# EAGLE design SH-SwitchNode-CT1 Shield (EAGLE 7.2.0)
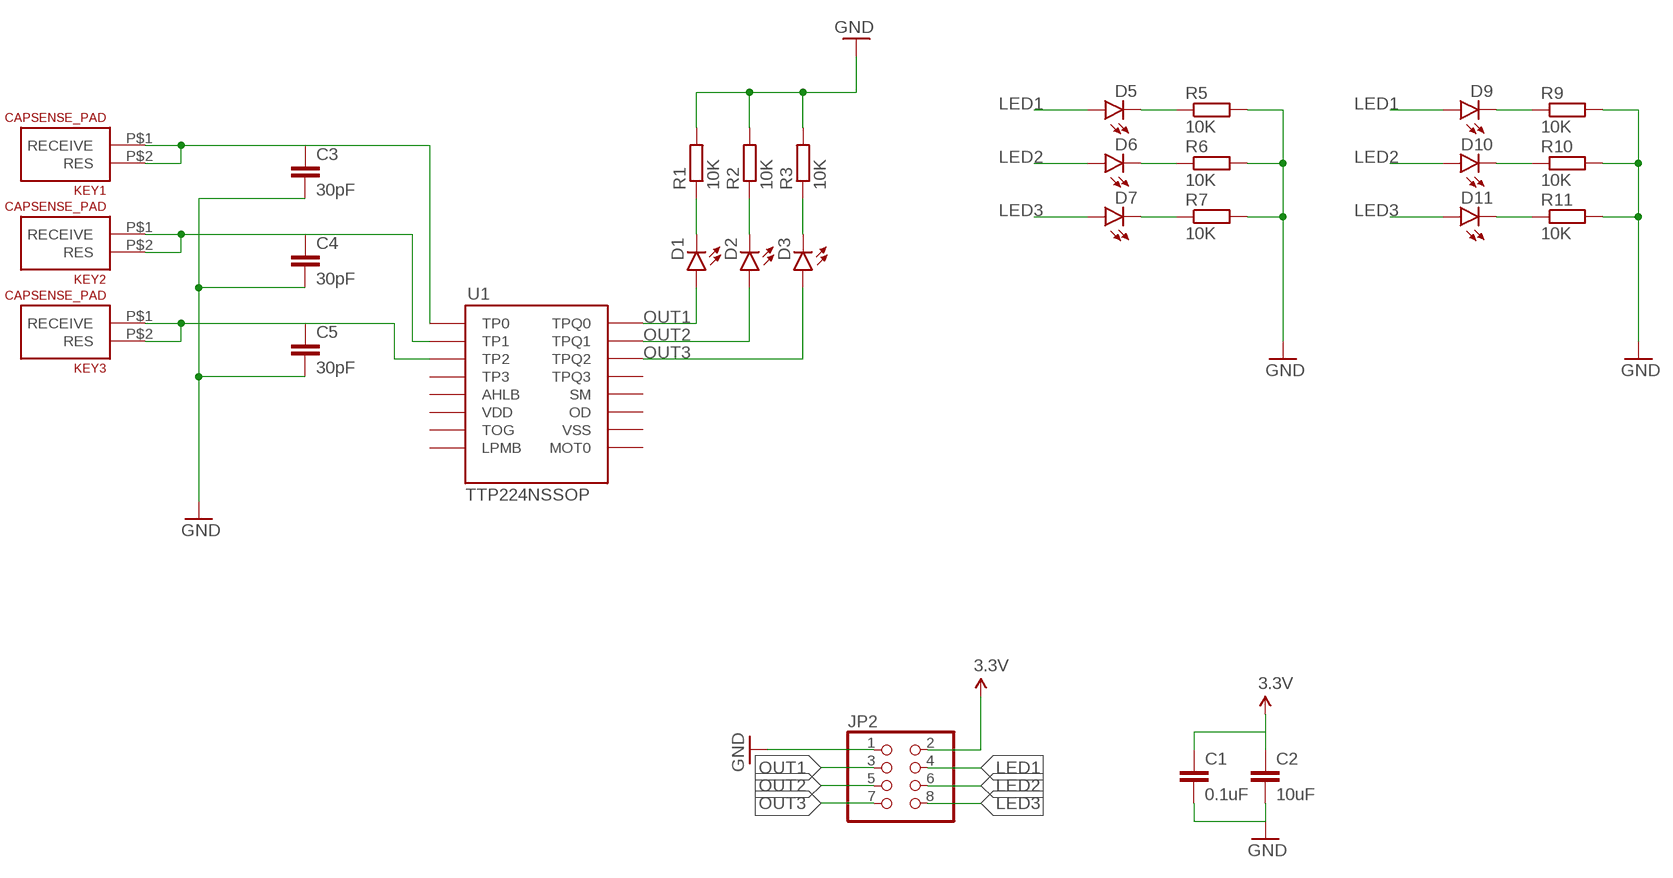
[diagram p0: schematic, sheet 1]

## Parts
C1  0.1uF  CAP0805  [0805]
C2  10uF  CAP0805  [0805]
C3  30pF  CAP0805  [0805]
C4  30pF  CAP0805  [0805]
C5  30pF  CAP0805  [0805]
D1  LED1206-BOTTOM  [LED-1206-BOTTOM]
D2  LED1206-BOTTOM  [LED-1206-BOTTOM]
D3  LED1206-BOTTOM  [LED-1206-BOTTOM]
D5  LED1206-BOTTOM  [LED-1206-BOTTOM]
D6  LED1206-BOTTOM  [LED-1206-BOTTOM]
D7  LED1206-BOTTOM  [LED-1206-BOTTOM]
D9  LED1206-BOTTOM  [LED-1206-BOTTOM]
D10  LED1206-BOTTOM  [LED-1206-BOTTOM]
D11  LED1206-BOTTOM  [LED-1206-BOTTOM]
JP2  PINHD-2X4  [2X04]
KEY1  CAPSENSE_PAD  [CAPSENSE_PAD]
KEY2  CAPSENSE_PAD  [CAPSENSE_PAD]
KEY3  CAPSENSE_PAD  [CAPSENSE_PAD]
R1  10K  R-EU_R0805  [R0805]
R2  10K  R-EU_R0805  [R0805]
R3  10K  R-EU_R0805  [R0805]
R5  10K  R-EU_R0805  [R0805]
R6  10K  R-EU_R0805  [R0805]
R7  10K  R-EU_R0805  [R0805]
R9  10K  R-EU_R0805  [R0805]
R10  10K  R-EU_R0805  [R0805]
R11  10K  R-EU_R0805  [R0805]
U1  TTP224NSSOP  [SSOP16]

## Nets
3.3V: C1.1 C2.1 JP2.2
GND: C1.2 C2.2 C3.2 C4.2 C5.2 JP2.1 R1.2 R2.2 R3.2 R5.2 R6.2 R7.2 R9.2 R10.2 R11.2
KEY1: C3.1 KEY1.P$1(RECEIVE) KEY1.P$2(RES) U1.1(TP0)
KEY2: C4.1 KEY2.P$1(RECEIVE) KEY2.P$2(RES) U1.2(TP1)
KEY3: C5.1 KEY3.P$1(RECEIVE) KEY3.P$2(RES) U1.3(TP2)
LED1: D5.A D9.A JP2.4
LED2: D6.A D10.A JP2.6
LED3: D7.A D11.A JP2.8
N$6: D5.C R5.1
N$7: D6.C R6.1
N$11: D1.C R1.1
N$12: D7.C R7.1
N$16: D9.C R9.1
N$18: D2.C R2.1
N$19: D3.C R3.1
N$21: D10.C R10.1
N$22: D11.C R11.1
OUT1: D1.A JP2.3 U1.16(TPQ0)
OUT2: D2.A JP2.5 U1.15(TPQ1)
OUT3: D3.A JP2.7 U1.14(TPQ2)
Unconnected: U1.4(TP3) U1.5(AHLB) U1.7(TOG) U1.8(LPMB) U1.9(MOT0) U1.11(OD) U1.12(SM) U1.13(TPQ3)

## Power pins joined to a net without a drawn wire
VDD: U1.6(VDD)
VSS: U1.10(VSS)

## Library data of the parts
C1-C5 = SparkFun-Capacitors:CAP: Capacitor Standard 0603 ceramic capacitor, and 0.1" leaded capacitor.
D1-D3 D5-D7 D9-D11 = SparkFun-LED:LED: LEDs Standard schematic elements and footprints for 5mm, 3mm, 1206, and 0603 sized LEDs. 5mm - Spark Fun Electronics SKU : COM-00529 (and others)
JP2 = adafruit:PINHD-2X4: PIN HEADER
KEY1-KEY3 = SparkFun-Electromechanical:CAPSENSE_PAD: Generic copper pad for a capacitive touch sensor.
R1-R3 R5-R7 R9-R11 = rcl:R-EU_: RESISTOR, European symbol
U1 = My Eagle Lib:TTP224N: The TTP224N-BSB TonTouchTM IC is capacitive sensing design specifically for touch pad controls. The device built in regulator for touch sensor. Stable sensing method can cover diversity conditions. Human interfaces control panel links through non-conductive dielectric material. The main application is focused at replacing of the mechanical switch or button. The ASSP can independently handle the 4 touch pads with 4 direct output pins.

## Board
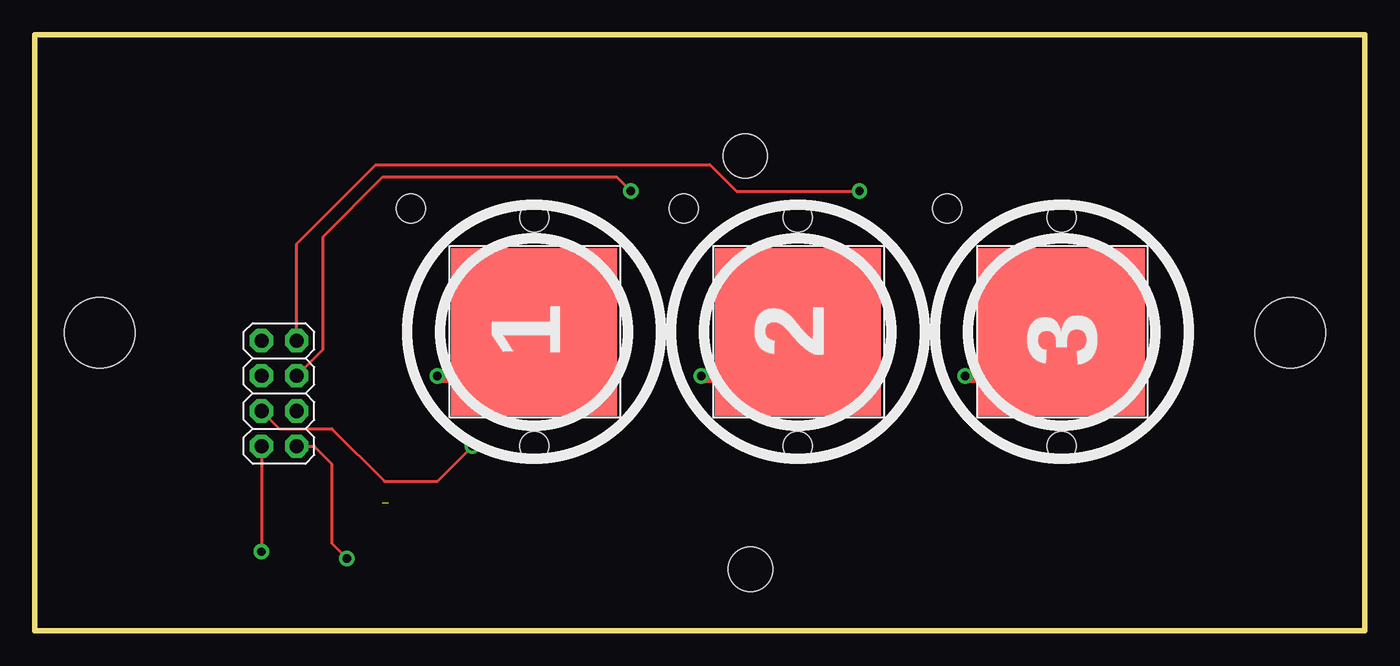
[diagram p1: board, top side]
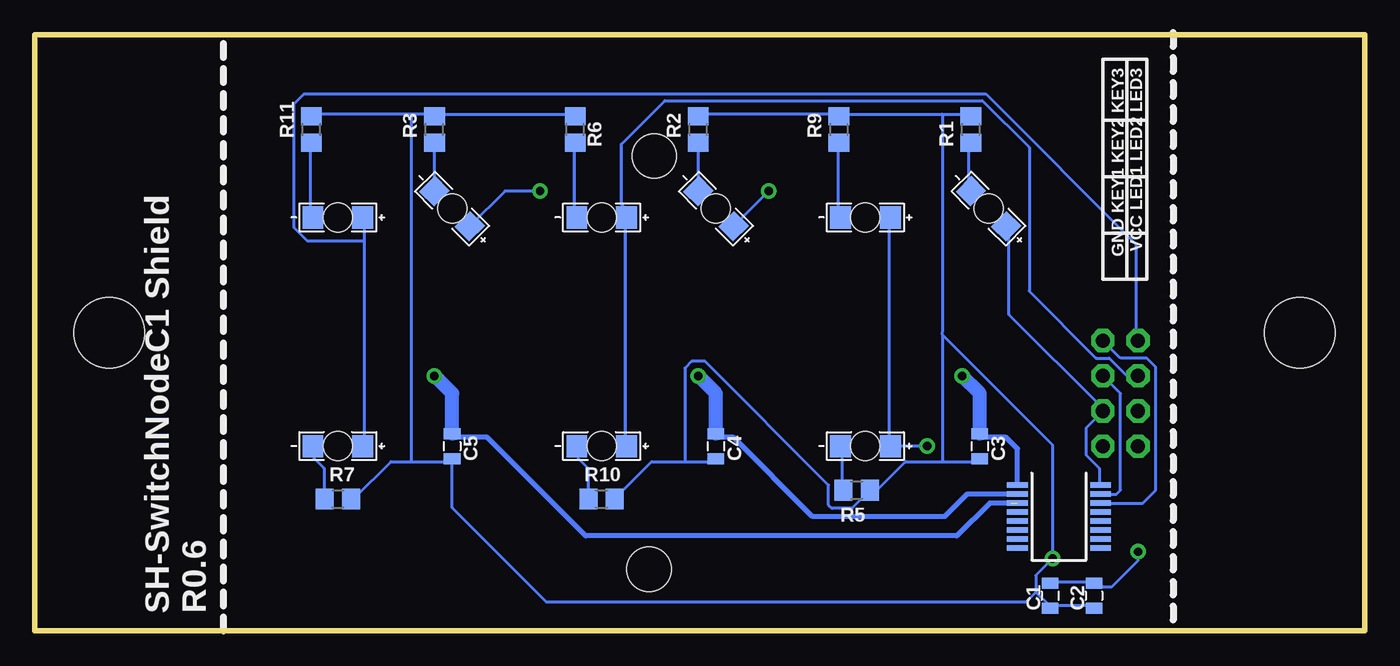
[diagram p2: board, bottom side, seen from below]

Size 96.06 x 43.04 mm. Coordinates in mm from the lower left corner, seen from the top.
Outline: 0,0 96.06,0 96.06,43.04 0,43.04 0,0
Copper layers (1*16): Top 0.035mm / dielectric 1.5mm / Bottom 0.035mm
Design rules "default *": minimum track width 9mil, minimum drill 24mil, track to track 10mil, track to pad 10mil, pad to pad 10mil, via to via 10mil, smd to smd 8mil, copper to edge 20mil, drill to drill 12mil, minimum pad ring 13mil, minimum via ring 10mil, stop-mask expansion 4mil, vias tented up to drill 0mil, thermal gap 10mil
Holes 3.2 mm at 51.31,34.29 51.69,4.45
Holes 5.08 mm at 4.7,21.52 90.68,21.52

### Footprints (pad centres in the part's own frame; a part is rotated, then mirrored left to right if it is on the bottom)
0805 = smd 0.8 x 1.2: 1 -0.9,0; 2 0.9,0
LED-1206-BOTTOM = smd 1.5 x 1.6: A -1.8,0; C 1.8,0 | hole 2.1: 0,0
2X04 = drill 1.016 pad 1.676 octagon: 1 -3.81,-1.27; 2 -3.81,1.27; 3 -1.27,-1.27; 4 -1.27,1.27; 5 1.27,-1.27; 6 1.27,1.27; 7 3.81,-1.27; 8 3.81,1.27
CAPSENSE_PAD = smd 12 x 6.1: P$1 0,3; P$2 0,-3
R0805 = smd 1.3 x 1.5: 1 -0.95,0; 2 0.95,0
SSOP16 = smd 0.4 x 1.5: 1 -2.275,-3.625; 2 -1.625,-3.625; 3 -0.975,-3.625; 4 -0.325,-3.625; 5 0.325,-3.625; 6 0.975,-3.625; 7 1.625,-3.625; 8 2.275,-3.625; 9 2.275,2.375; 10 1.625,2.375; 11 0.975,2.375; 12 0.325,2.375; 13 -0.325,2.375; 14 -0.975,2.375; 15 -1.625,2.375; 16 -2.275,2.375

### Placement (x,y rotation side)
C1  22.73,2.54 270 bottom
C2  19.56,2.54 270 bottom
C3  27.81,13.34 270 bottom
C4  46.86,13.34 270 bottom
C5  65.91,13.34 270 bottom
D1  27.18,30.48 135 bottom
D2  46.86,30.48 135 bottom
D3  65.91,30.48 135 bottom
D5  36.07,13.34 180 bottom
D6  55.12,29.84 180 bottom
D7  74.17,13.34 180 bottom
D9  36.07,29.84 180 bottom
D10  55.12,13.34 180 bottom
D11  74.17,29.84 180 bottom
JP2  17.65,17.14 90 top
KEY1  36.07,21.59 0 top
KEY2  55.12,21.59 0 top
KEY3  74.17,21.59 0 top
R1  28.45,36.19 90 bottom
R2  48.13,36.19 90 bottom
R3  67.18,36.19 90 bottom
R5  36.7,10.16 0 bottom
R6  57.02,36.19 90 bottom
R7  74.17,9.52 0 bottom
R9  37.97,36.19 90 bottom
R10  55.12,9.52 0 bottom
R11  76.07,36.19 90 bottom
U1  21.46,8.25 270 bottom

### Tracks (layer width: path | path; a pad name or v marks a point on that pad's centre or on a via)
3.3V  (via drill 0.61)
  Top 0.229: JP2.2 v16.38,5.71
  Bottom 0.229: C1.1 22.55,3.53 19.66,3.53 C2.1 19.19,3.44 18.92,3.17 18.29,3.17 16.38,5.08 v16.38,5.71
GND  (via drill 0.61)
  Top 0.229: JP2.1 20.19,13.34 21.46,12.06 21.46,6.31 v22.55,5.22
  Bottom 0.229: 68.88,12.22 70.33,12.22 72.99,9.56 R7.2 | 68.88,12.22 65.99,12.22 C5.2 | R6.2 57.06,37.31 66.95,37.31 R3.2 67.2,37.31 68.88,37.31 | 68.88,37.31 75.88,37.31 R11.2 | 68.88,37.31 68.88,12.22 | C2.2 19.66,1.84 22.55,1.84 C1.2 22.8,1.84 23.76,2.81 | 23.76,2.81 23.76,4.01 v22.55,5.22 22.55,13.42 30.52,21.39 | 49.1,12.22 51.51,12.22 54.17,9.56 R10.2 | 49.1,12.22 46.93,12.22 C4.2 | 30.52,12.22 33.17,12.22 35.1,10.29 35.59,10.29 R5.2 35.83,10.05 37.03,8.84 38.48,8.84 38.72,9.08 38.72,10.53 47.65,19.46 48.62,19.46 49.1,18.97 49.1,12.22 | 30.52,12.22 27.86,12.22 C3.2 | 30.52,37.31 37.76,37.31 R9.2 38,37.31 48.13,37.31 R2.2 | 30.52,37.31 28.59,37.31 R1.2 | 30.52,37.31 30.52,21.59 30.52,21.39 | 30.52,21.39 30.52,12.22 | 23.76,2.81 24.49,2.08 59.11,2.08 65.91,8.89 C5.2 | 65.75,12.22 C5.2
  pour Top (isolate 7.62): -2.67,45.08 99.57,45.08 99.57,-2.54 -2.67,-2.54
  pour Bottom (isolate 7.62): -2.67,45.08 99.57,45.08 99.57,-2.54 -2.67,-2.54 -2.67,44.45
KEY1  (via drill 0.61)
  Top 0.229: KEY1.P$2 KEY1.P$1
  Top 0.457: 35.89,18.41 KEY1.P$2
  Top 1.016: v29.08,18.41 35.89,18.41
  Bottom 0.356: C3.1 27.55,13.97 25.91,13.97 25.09,13.15 U1.1
  Bottom 1.016: C3.1 27.81,17.14 v29.08,18.41
KEY2  (via drill 0.61)
  Top 0.229: KEY2.P$1 55.13,24.52 55.13,18.73 KEY2.P$2
  Top 0.457: 54.94,18.41 KEY2.P$2
  Top 1.016: v48.13,18.41 54.94,18.41
  Bottom 0.356: C4.1 46.6,13.97 45.59,13.97 39.88,8.25 30.35,8.25 28.73,9.88 U1.2
  Bottom 1.016: C4.1 46.86,17.14 v48.13,18.41
KEY3  (via drill 0.61)  (1 unrouted)
  Top 0.229: KEY3.P$1 74.19,24.52 74.19,18.73 KEY3.P$2
  Top 0.457: 73.99,18.41 KEY3.P$2
  Top 1.016: v67.18,18.41 73.99,18.41
  Bottom 0.356: C5.1 65.65,13.97 63.37,13.97 56.26,6.86 29.46,6.86 27.09,9.23 25.57,9.23
  Bottom 1.016: C5.1 65.91,17.14 v67.18,18.41
LED1  (via drill 0.61)
  Top 0.229: JP2.4 17.65,14.6 21.46,14.6 25.27,10.79 29.08,10.79 v31.62,13.34
  Bottom 0.229: D9.A 34.38,29.83 34.38,13.42 D5.A v31.62,13.34
LED2
  Bottom 0.229: D10.A 53.44,13.42 53.44,29.83 D6.A 53.44,30.07 53.44,30.56 53.68,30.8 53.68,35.14 50.55,38.28 27.62,38.28 24.24,34.9 24.24,24.52 19.42,19.7 18.45,19.7 17.25,18.49 16.52,18.49 JP2.6
LED3
  Bottom 0.229: 72.26,28.14 72.26,29.83 D11.A | 72.26,28.14 72.26,13.42 D7.A | JP2.8 16.52,21.15 16.52,27.9 27.38,38.76 76.61,38.76 77.33,38.04 77.33,29.11 76.37,28.14 72.26,28.14
N$6
  Bottom 0.229: R5.1 37.76,10.29 37.76,13.18 D5.C
N$7
  Bottom 0.229: R6.1 57.06,35.14 57.06,30.07 D6.C
N$11
  Bottom 0.229: R1.1 28.59,35.14 28.59,31.76 D1.C
N$12
  Bottom 0.229: R7.1 75.16,9.56 75.16,11.73 75.88,12.46 75.88,13.18 D7.C
N$16
  Bottom 0.229: R9.1 38,35.14 38,30.07 D9.C
N$18
  Bottom 0.229: R2.1 48.13,31.76 D2.C
N$19
  Bottom 0.229: R3.1 67.2,35.14 67.2,31.76 D3.C
N$21
  Bottom 0.229: R10.1 56.1,9.56 56.1,11.73 56.82,12.46 56.82,13.18 D10.C
N$22
  Bottom 0.229: R11.1 76.12,35.14 76.12,30.07 D11.C
OUT1
  Bottom 0.229: U1.16 19.18,10.53 19.18,11.73 20.14,12.7 20.14,14.63 18.94,15.84 JP2.3 18.94,16.08 25.69,22.84 25.69,29.11 D1.A
OUT2  (via drill 0.61)
  Top 0.229: JP2.5 20.83,20.32 20.83,28.45 25.15,32.77 42.04,32.77 v43.05,31.75
  Bottom 0.229: v43.05,31.75 v43.05,31.74 D2.A | U1.15 17.93,9.88 17.65,10.16 17.65,17.14 JP2.5
OUT3  (via drill 0.61)
  Top 0.229: JP2.7 18.94,21.15 18.94,27.95 24.64,33.66 48.77,33.66 50.67,31.75 v59.56,31.75
  Bottom 0.229: 64.54,29.11 D3.A 62.1,31.75 v59.56,31.75 | U1.14 16.04,9.23 15.11,10.16 15.11,19.05 15.75,19.68 17.65,19.68 JP2.7

### Text on the board
tNames: 1 | 2 | 3
bNames: GND KEY1 KEY2 KEY3 / VCC LED1 LED2 LED3 | SH-SwitchNodeC1 Shield / R0.6